# Altium schematic sheet FPGAMisc.SchDoc: FPGA - Miscellaneous
size A3; Organization: Altium Limited; Address1: L3, 12a Rodborough Rd; Address2: Frenchs Forest; Address3: NSW; Address4: Australia 2086; DocumentNumber: 7; Revision: 1.0; SheetNumber: 7; SheetTotal: 8; SheetSize: A3
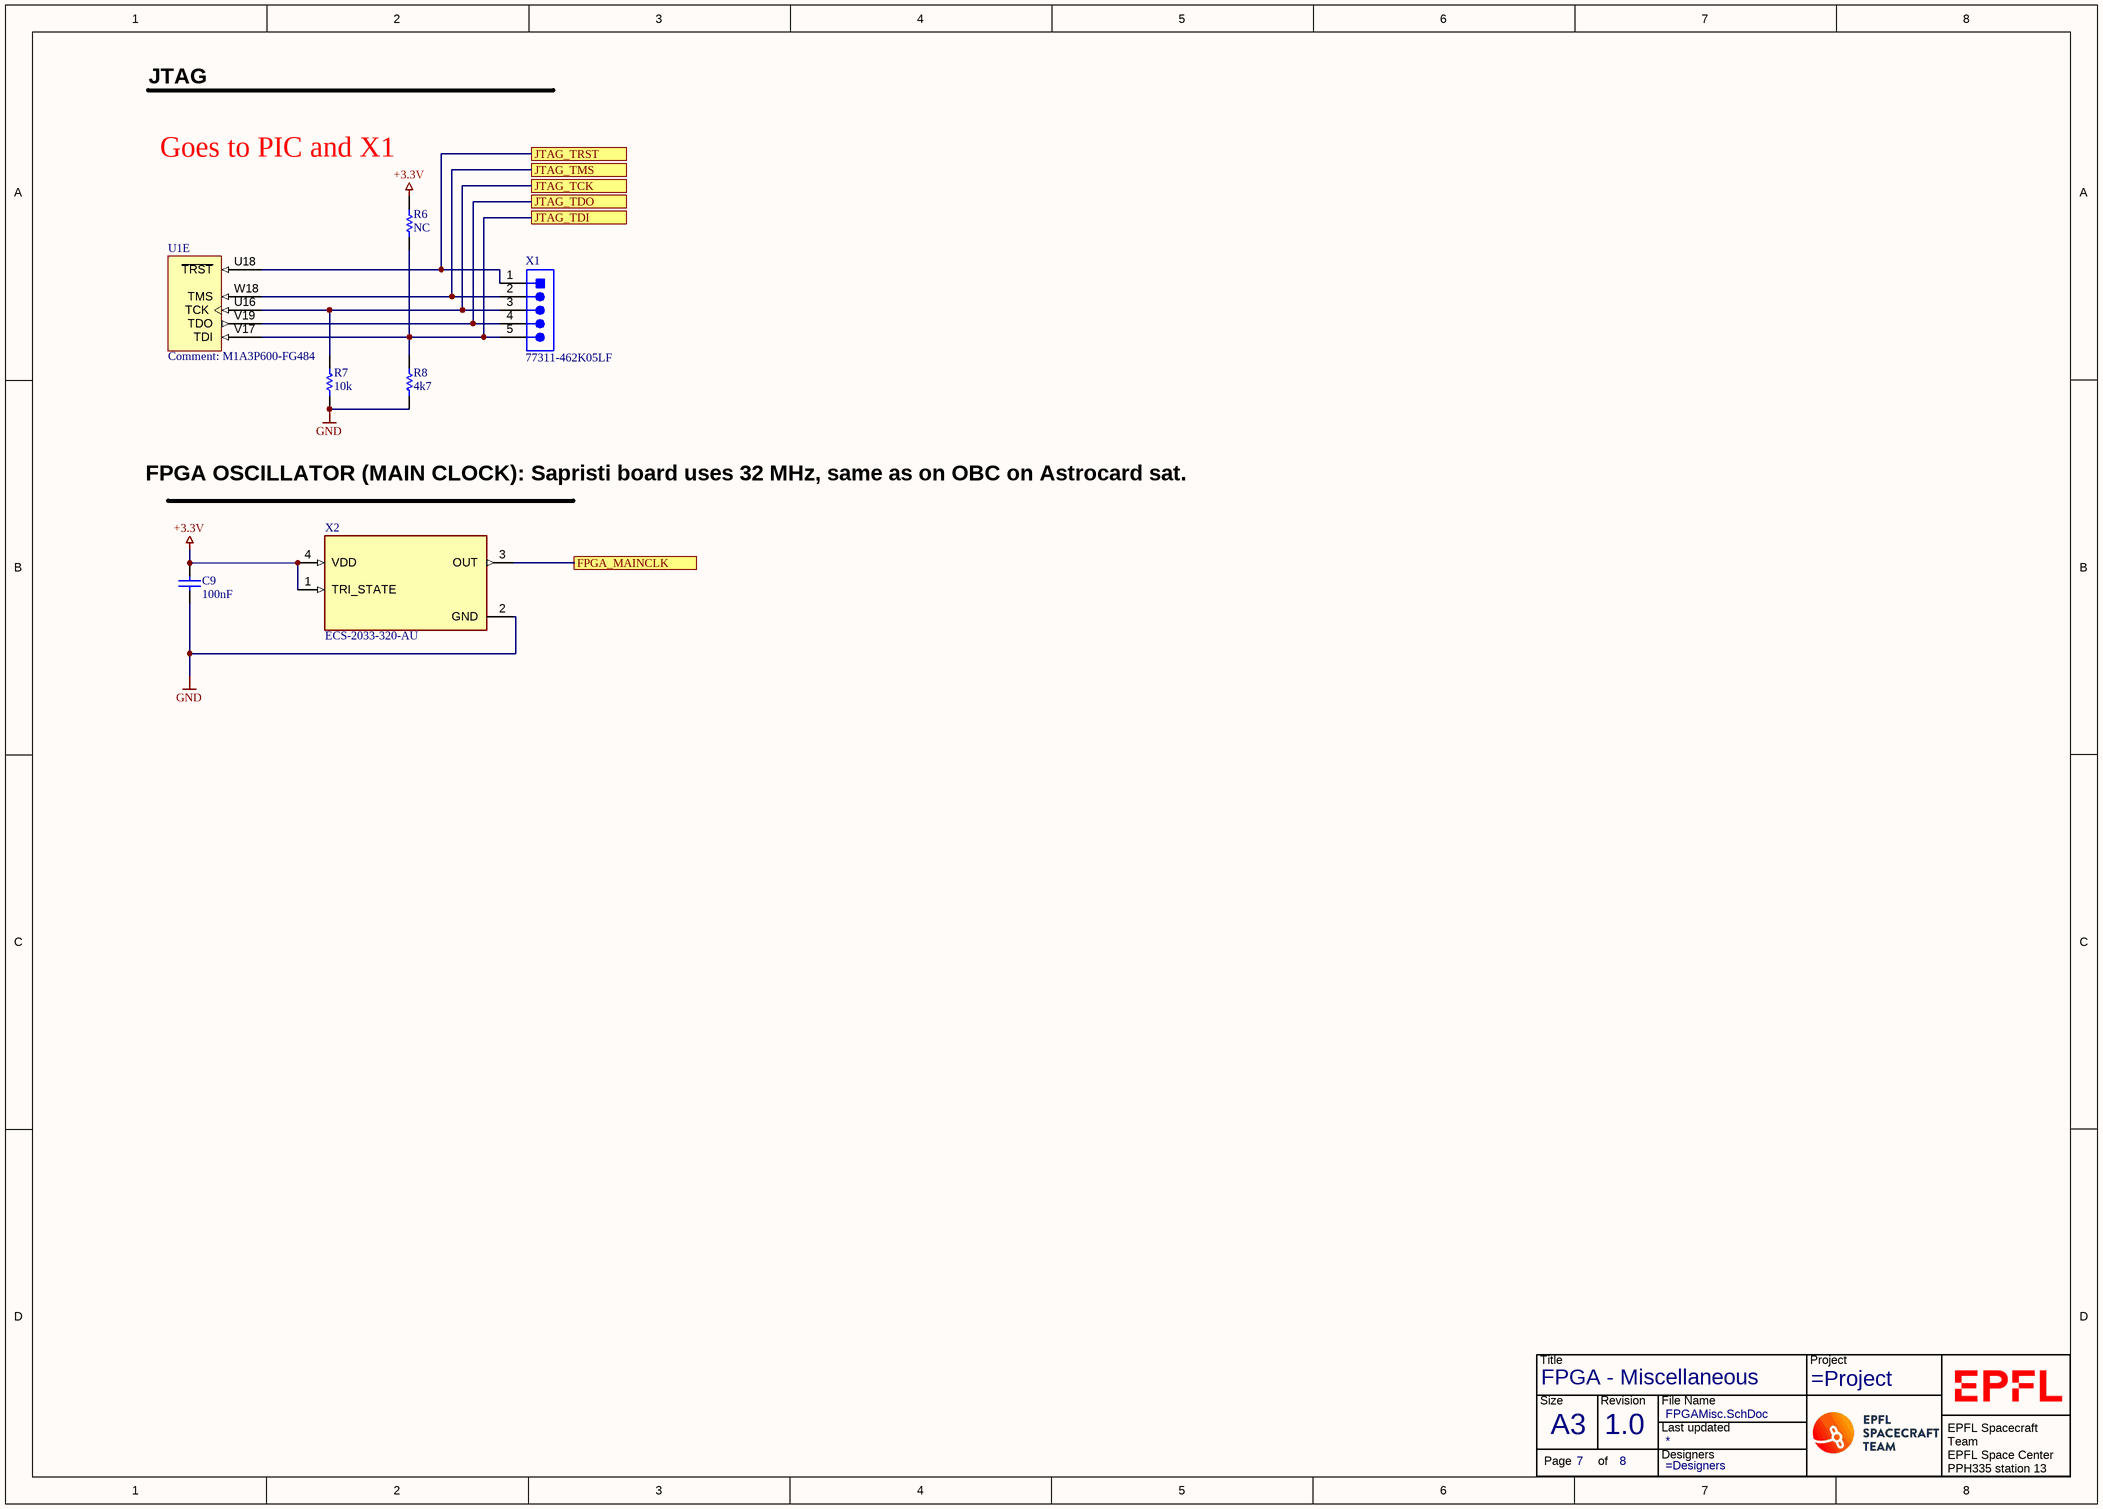
[diagram p0: FPGAMisc.SchDoc]

## Parts
*  TitleBlock  (value not drawn)  (graphical)
C9  100nF  [CAPC1005X60X30ML05T10]
R6  NC  [RESC1005X40X25LL05T10]
R7  10k  [RESC1005X40X25LL05T10]
R8  4k7  [RESC1005X40X25LL05T10]
U1  M1A3P600-FG484  [FG484]  (part E of 8)
X1  77311-462K05LF  [FCI-77311-5_V]
X2  ECS-2033-320-AU  [OSC_ECS-2033-320-AU]

## Ports
FPGA_MAINCLK, JTAG_TCK, JTAG_TDI, JTAG_TDO, JTAG_TMS, JTAG_TRST

## Nets
+3.3V: C9.2 R6.2 X2.1(TRI_STATE) X2.4(VDD)
GND: C9.1 R7.1 R8.1 X2.2(GND)
FPGA_MAINCLK: X2.3(OUT) ; port FPGA_MAINCLK
JTAG_TCK: R7.2 U1.U16(TCK) X1.3(TXO) ; port JTAG_TCK
JTAG_TDI: R6.1 R8.2 U1.V17(TDI) X1.5(CTS) ; port JTAG_TDI
JTAG_TDO: U1.V19(TDO) X1.4(VCC) ; port JTAG_TDO
JTAG_TMS: U1.W18(TMS) X1.2(RXI) ; port JTAG_TMS
JTAG_TRST: U1.U18(~{TRST}) X1.1(DTR) ; port JTAG_TRST

## Notes on the sheet
- JTAG
- (near R6) Goes to PIC and X1
- FPGA OSCILLATOR (MAIN CLOCK): Sapristi board uses 32 MHz, same as on OBC on Astrocard sat.
- 8
- 7
- 6
- 5
- 4
- 3
- DWG. NO.
- REV.
- SHT.
- REVISION
- 2
- DESCRIPTION
- DATE
- 1
- APPROVED
- THIS DOCUMENT AND THE DATA DISCLOSED HEREIN OR HEREWITH IS THE PROPERTY OF ALTIUM LIMITED AND MAY BE FREELY DISTRIBUTED IN WHOLE. NO RIGHTS ARE RESERVED OR EXPRESS OR IMPLIED WARANTEE GIVEN.
- F
- E
- D
- C
- B
- ENG:
- APPROVALS
- PROJECT
- A
- DSN:
- CHK:
- REFERENCE DOCUMENTS
- PROJECT REVISION:
- TITLE
- DOCUMENT REVISION:
- DESIGN ITEM:
- BOM:
- FAB DWG:
- PCB DWG:
- ASSY DWG:
- SCALE:
- A3
- SIZE
- CAGE CODE
- FILE NAME
- DWG NO.
- SHEET
- OF
- REV
- (in symbol TitleBlock) Title; Project; Size; Revision; File Name; Last updated; Designers; Page; of; EPFL Spacecraft Team / EPFL Space Center / PPH335 station 13 / CH-1015 Lausanne

## Library data of the parts
* = TitleBlock: Title Block with generall information
C9 = CMP-2008-02046-1: Manufacturer: Kemet; Part Number: C0402C104K8PACTU
R6-R8 = CMP-2002-07353-1: Part Number: RC0402FR-0710KL; Manufacturer: Yageo / Phycomp
U1 = CMP-0097-00007-1: M1-Ready ProASIC3 Flash Family FPGA, 235 User IOs, 600K System Gates, 108 Kbits RAM, 1 Kbit Flash ROM, 1 PLL, 484-Ball FBGA, Commercial Grade; Code_JEDEC: MS-034-AAJ-1; PackageDescription: 484-Ball Fine Pitch Plastic Ball Grid Array (FG484) - Fully Populated; DatasheetVersion: v1.3, Oct-2009; PackageReference: FG484; PackageVersion: ver11.2, Nov-2009; Code_IPC: BGA100P22X22-484
X1 = CMP-1698-00006-1: Male Header, Pitch 2.54 mm, 1 x 5 Position, Height 16.24 mm, Tail Length 3.05 mm, / -65 to 125 degC, RoHS, Tape and Reel; Shielding: Shielded; Current Rating: 1 A; Gender: Female; ComponentLink2URL: http://portal.fciconnect.com/Comergent//fci/drawing/77311.pdf; ComponentLink1URL: http://portal.fciconnect.com/; ComponentLink2Description: Datasheet; Max Operating Temperature: 85degC; Package Quantity: 500; PackageDescription: Male Header, Pitch 2.54 mm, 1 x 5 Position, Height 16.24 mm, Tail Length 3.05 mm; ComponentLink1Description: Manufacturer URL; Min Operating Temperature: -25degC; Contact Material: Brass; PackageReference: 77311-5; RoHSCompliant: True; Packaging: Tape and Reel; DatasheetVersion: Rev. CK, 07/2016
X2 = ECS-2033-320-AU: Osc Xo 32.000mhz Cmos Smd; MF: ECS International; SnapEDA_Link: https://www.snapeda.com/parts/ECS-2033-320-AU/ECS%20International/view-part/2456319/?ref=snap; MP: ECS-2033-320-AU; Value: *; Digi-Key_Part_Number: XC1864CT-ND; Package: SMD-4 ECS International